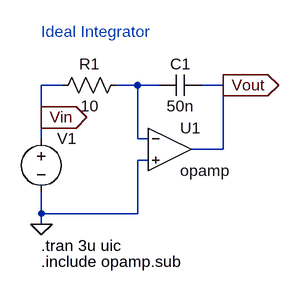
[diagram p0: schematic INTEGR.asc]
INTEGR.asc, the LTspice schematic file:
Version 4.1
SHEET 1 1676 680
WIRE 96 64 64 64
WIRE 208 64 176 64
WIRE 240 64 208 64
WIRE 336 64 304 64
WIRE 64 112 64 64
WIRE 64 144 64 112
WIRE 208 144 208 64
WIRE 224 144 208 144
WIRE 336 160 336 64
WIRE 336 160 288 160
WIRE 224 176 208 176
WIRE 64 256 64 224
WIRE 208 256 208 176
WIRE 208 256 64 256
WIRE 64 272 64 256
FLAG 64 272 0
FLAG 336 64 Vout
IOPIN 336 64 Out
FLAG 64 112 Vin
IOPIN 64 112 Out
SYMBOL voltage 64 128 R0
WINDOW 123 0 0 Left 0
WINDOW 39 0 0 Left 0
WINDOW 3 24 96 Invisible 2
SYMATTR InstName V1
SYMATTR Value PWL(0 0 0.001u 1 0.499u 1 0.501u -1 0.999u -1 1.001u 1 1.499u 1 1.501u -1 1.999u -1 2.001u 1 2.499u 1 2.501u -1 2.999u -1 3.001u 1)
SYMBOL OpAmps\\opamp 256 96 R0
SYMATTR InstName U1
SYMBOL res 192 48 R90
WINDOW 0 0 56 VBottom 2
WINDOW 3 32 56 VTop 2
SYMATTR InstName R1
SYMATTR Value 10
SYMBOL cap 304 48 R90
WINDOW 0 0 32 VBottom 2
WINDOW 3 32 32 VTop 2
SYMATTR InstName C1
SYMATTR Value 50n
TEXT 64 304 Left 2 !.tran 3u uic
TEXT 64 328 Left 2 !.include opamp.sub
TEXT 64 -16 Left 2 ;Ideal Integrator

The netlist it stands for:
* INTEGR.asc
V1 Vin 0 PWL(0 0 0.001u 1 0.499u 1 0.501u -1 0.999u -1 1.001u 1 1.499u 1 1.501u -1 1.999u -1 2.001u 1 2.499u 1 2.501u -1 2.999u -1 3.001u 1)
X§U1 N001 0 Vout opamp Aol=100K GBW=10Meg  ; pins invin noninvin out
R1 N001 Vin 10
C1 Vout N001 50n
.tran 3u uic
.include opamp.sub
* Ideal Integrator
.backanno
.end